# Altium schematic sheet DC.SchDoc
size Letter; Author: Diego Terraza; Revision: 1.0; SheetNumber: 1; SheetTotal: 2; Curso: IE3028; Carnet: 21601
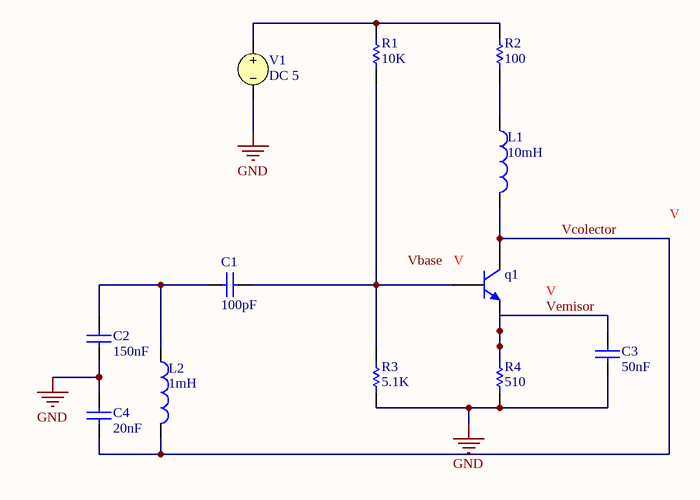
[diagram p0: DC.SchDoc]

## Parts
C1  value 100pF  (hidden comment: Capacitor)
C2  value 150nF  (hidden comment: Capacitor)
C3  value 50nF  (hidden comment: Capacitor)
C4  value 20nF  (hidden comment: Capacitor)
L1  value 10mH  (hidden comment: Inductor)
L2  value 1mH  (hidden comment: Inductor)
q1  Bipolar NPN 3 Pins Transistor VBIC Model  (value not drawn)
R1  value 10K  (hidden comment: Resistor)
R2  value 100  (hidden comment: Resistor)
R3  value 5.1K  (hidden comment: Resistor)
R4  value 510  (hidden comment: Resistor)
V1  DC 5

## Nets
GND: C2.2 C3.2 C4.1 R3.2 R4.2 V1.2
Vcolector: C4.2 L1.2 L2.2 q1.1(C)
Vemisor: C3.1 q1.3(E) R4.1
NetC1_1: C1.1 q1.2(B) R1.2 R3.1
NetC1_2: C1.2 C2.1 L2.1
NetL1_1: L1.1 R2.2
NetR1_1: R1.1 R2.1 V1.1

## Notes on the sheet
- Labels drawn without touching a wire or pin: Vbase
- Text
- Proyecto:
- Documento:
- Autor:
- Carnet:
- Fecha:
- Revisión:
- Curso:
- Tamaño:
- Hoja:
- de
- Carta

## Library data of the parts
C1-C4 = Capacitor: SimulationGenericComponent: True
L1 L2 = Inductor: SimulationGenericComponent: True
q1 = BJT NPN VBIC: SimulationGenericComponent: True; AFN: 1; AJC: -0.5; ART: 0.1; AVC1: 0; EA: 1.12; FC: 0.9; IBBE: 1e-06; IBCI: 1e-16; IBEI: 1e-18; MC: 0.33; NCN: 2; NKF: 0.5; PC: 0.75; TNOM: 27; VERS: 1.2; XII: 3; AJE: -0.5; AJS: -0.5; AVC2: 0; BFN: 1; CBCO: 0; CBEO: 0; CCSO: 0; CJC: 0; CJCP: 0; CJE: 0; CJEP: 0; CTH: 0; DEAR: 0; EAIC: 1.12; EAIE: 1.12; EAIS: 1.12; EANC: 1.12; EANE: 1.12; EANS: 1.12; EAP: 1.12; EBBE: 0; GAMM: 0; HRCF: 1; IBCIP: 0; IBCN: 0; IBCNP: 0; IBEIP: 0; IBEN: 0; IBENP: 0; IKF: 0; IKP: 0; IKR: 0; IS: 1e-16; ISP: 0; ISRR: 1; ITF: 0; KFN: 0; ME: 0.33; MS: 0.33; NBBE: 1; NCI: 1; NCIP: 1; NCNP: 2; NEI: 1; NEN: 2; NF: 1; NFP: 1; NR: 1; PE: 0.75; PS: 0.75; QBM: 0; QCO: 0; QTF: 0; RBI: 0.1; RBP: 0.1; RBX: 0; RCI: 0.1; RCX: 0; RE: 0; RS: 0; RTH: 0; TAVC: 0; TD: 0; TF: 0; TNBBE: 0; TNF: 0; TR: 0; TVBBE1: 0; TVBBE2: 0; VBBE: 0; VEF: 0; VER: 0; VO: 0; VREF: 0; VRT: 0; VTF: 0; WBE: 1; WSP: 1; XIKF: 0; XIN: 3; XIS: 3; XISR: 0; XRBI: 0; XRBP: 0; XRBX: 0; XRCI: 0; XRCX: 0; XRE: 0; XRS: 0; XTF: 0; XVO: 0
R1-R4 = Resistor: TC1: 0; SimulationGenericComponent: True; TC2: 0
V1 = VSRC: Voltage Source; Note: PCB Footprint - Not required; AC Magnitude: 1; AC Phase: 0; Value: 5; Published: 8-Jun-2000; LatestRevisionDate: 17-Jul-2002; LatestRevisionNote: Re-released for DXP Platform.; PackageReference: Not Applicable; Publisher: Altium Limited